# EAGLE design Grove - Mini I2C Motor Driver v1.0 (EAGLE 7.1.0)

## Sheet 1 of 2
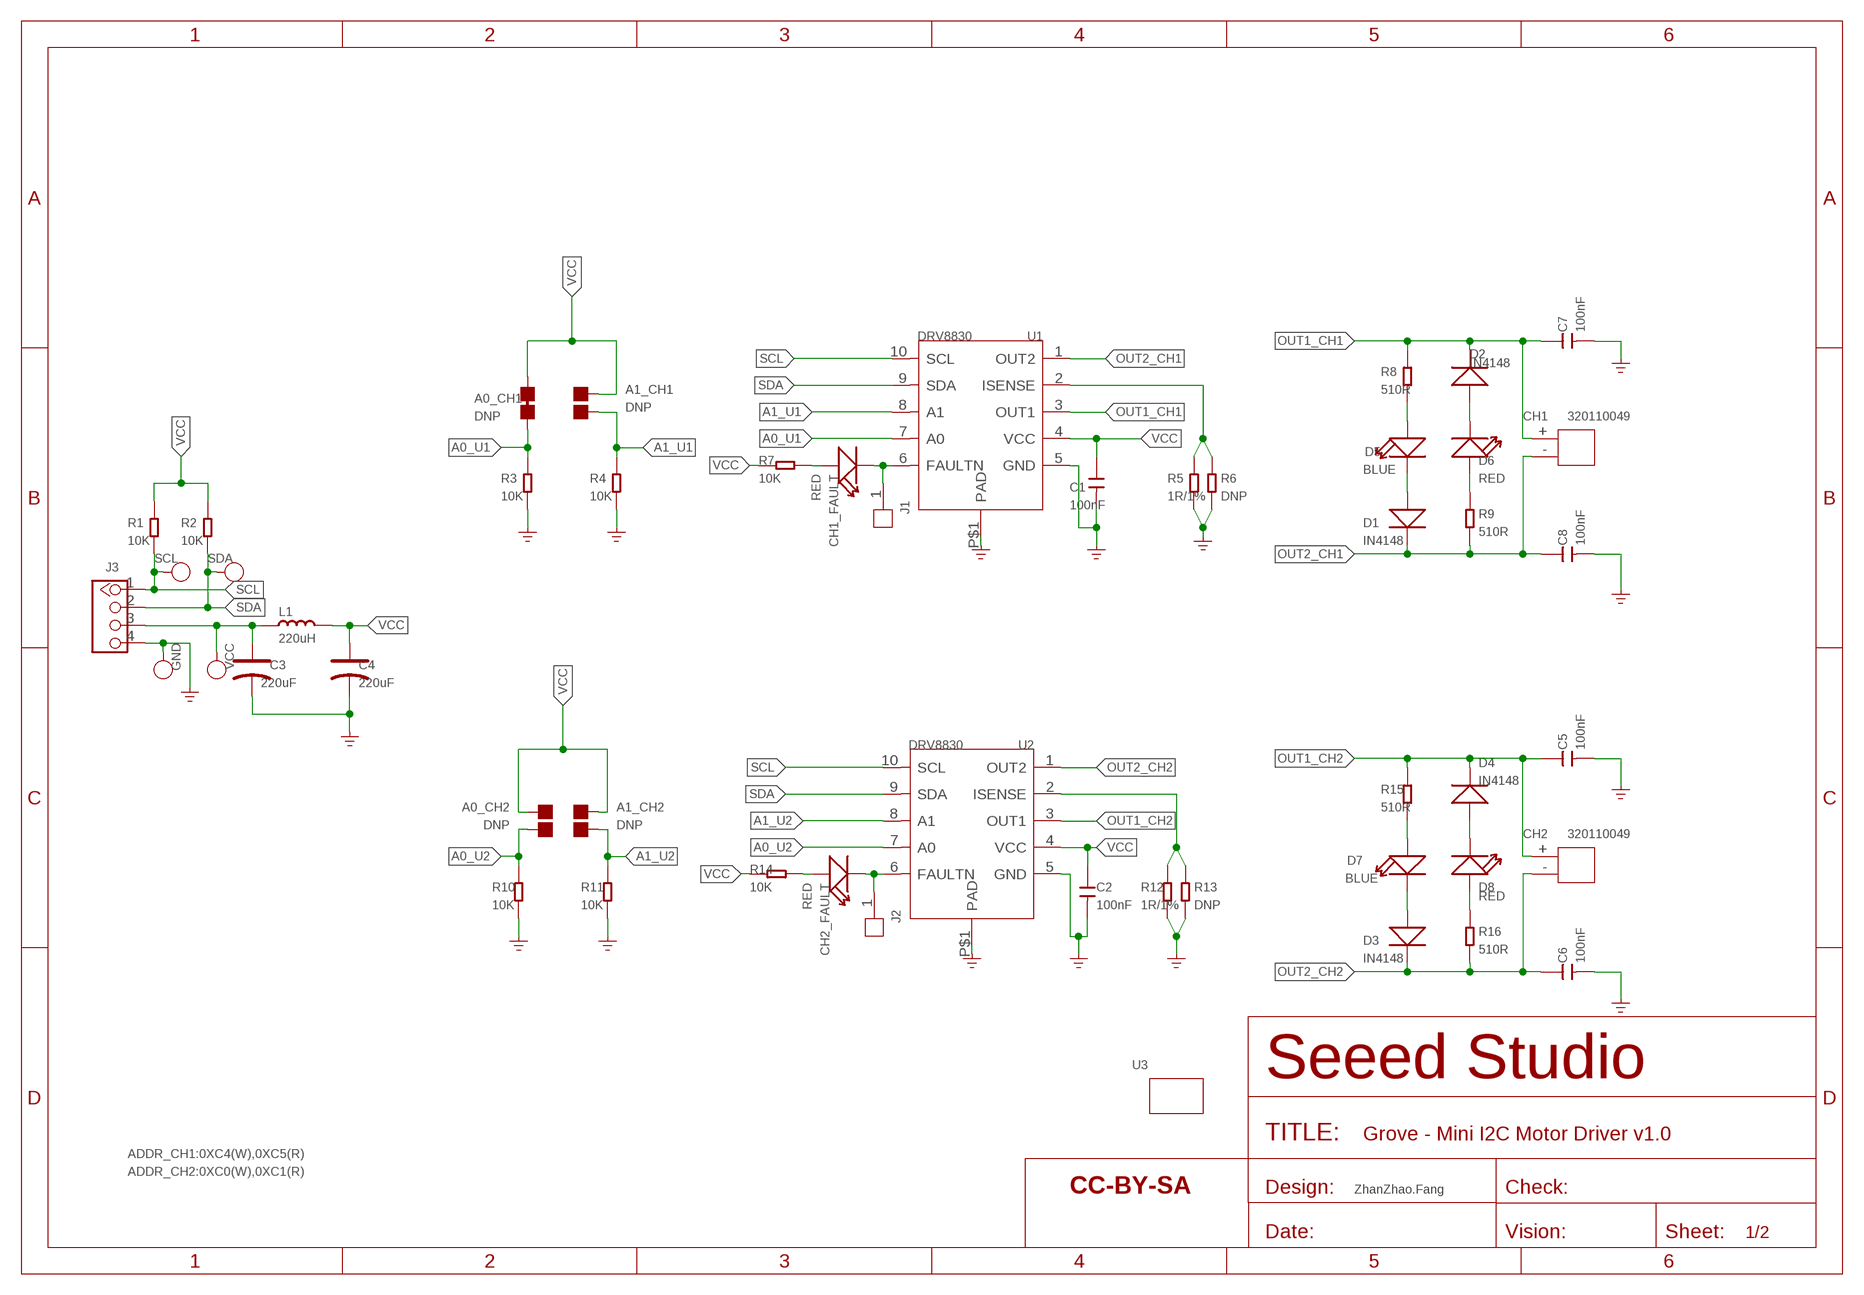
[diagram p0: schematic, sheet 1]

### Parts
A0_CH1  DNP  JUMPER-2P-SHORT  [2P-SMD-SHORT]
A0_CH2  DNP  JUMPER-2P  [JUMPER-2P]
A1_CH1  DNP  JUMPER-2P  [JUMPER-2P]
A1_CH2  DNP  JUMPER-2P  [JUMPER-2P]
C1  100nF  CAP-0603  [C0603]
C2  100nF  CAP-0603  [C0603]
C3  220uF  CAP-POLAR-AVX-B  [AVX-B]
C4  220uF  CAP-POLAR-AVX-B  [AVX-B]
C5  100nF  CAP-0603  [C0603]
C6  100nF  CAP-0603  [C0603]
C7  100nF  CAP-0603  [C0603]
C8  100nF  CAP-0603  [C0603]
CH1  320110049  JST-2P-DIP'2.0'  [H2-2.0-6X4.5MM]
CH1_FAULT  RED  LED'0603'  [LED-0603]
CH2  320110049  JST-2P-DIP'2.0'  [H2-2.0-6X4.5MM]
CH2_FAULT  RED  LED'0603'  [LED-0603]
D1  IN4148  DIODE'0805'  [SOD-323]
D2  IN4148  DIODE'0805'  [SOD-323]
D3  IN4148  DIODE'0805'  [SOD-323]
D4  IN4148  DIODE'0805'  [SOD-323]
D5  BLUE  LED'0603'  [LED-0603]
D6  RED  LED'0603'  [LED-0603]
D7  BLUE  LED'0603'  [LED-0603]
D8  RED  LED'0603'  [LED-0603]
GND  DNP  TEST-POINT'4545'  [TP-D45MIL]
J1  HEADER-1P-40  [1P-80/40MIL]
J2  HEADER-1P-40  [1P-80/40MIL]
J3  GROVE-CONNECTOR-DIP-2.0  [HW4-2.0]
L1  220uH  INDUCTOR/FERRITE-BEAD  [INT2-SMD-4.8X4.8X3MM]
R1  10K  RES-0603  [R0603]
R2  10K  RES-0603  [R0603]
R3  10K  RES-0603  [R0603]
R4  10K  RES-0603  [R0603]
R5  1R/1%  RES-0603  [R0603]
R6  DNP  RES-0603  [R0603]
R7  10K  RES-0603  [R0603]
R8  510R  RES-0603  [R0603]
R9  510R  RES-0603  [R0603]
R10  10K  RES-0603  [R0603]
R11  10K  RES-0603  [R0603]
R12  1R/1%  RES-0603  [R0603]
R13  DNP  RES-0603  [R0603]
R14  10K  RES-0603  [R0603]
R15  510R  RES-0603  [R0603]
R16  510R  RES-0603  [R0603]
SCL  DNP  TEST-POINT'4545'  [TP-D45MIL]
SDA  DNP  TEST-POINT'4545'  [TP-D45MIL]
U1  DRV8830  DRIVER-DRV8830  [MSOP10-0.5-3X3MM]
U2  DRV8830  DRIVER-DRV8830  [MSOP10-0.5-3X3MM]
U3  GROVE'2U'  [GROVE-1*2-TEST-PLATFORM]
U$1  SEEEDSTUDIO-OPEN-SCH-FRAME  [SEEEDSTUDIO-PCB-FRAME]
VCC  DNP  TEST-POINT'4545'  [TP-D45MIL]

### Nets
A0_U1: A0_CH1.1 R3.2 U1.7(A0)
A0_U2: A0_CH2.1 R10.2 U2.7(A0)
A1_U1: A1_CH1.1 R4.2 U1.8(A1)
A1_U2: A1_CH2.1 R11.2 U2.8(A1)
GND: C1.2 C2.2 C3.- C4.- C5.2 C6.2 C7.2 C8.2 GND.T J3.4 R3.1 R4.1 R5.1 R6.1 R10.1 R11.1 R12.1 R13.1 U1.5(GND) U1.P$1(PAD) U2.5(GND) U2.P$1(PAD) ; supply symbol labelled GND_POWER
N$1: R5.2 R6.2 U1.2(ISENSE)
N$2: R12.2 R13.2 U2.2(ISENSE)
N$3: CH1_FAULT.- J1.1 U1.6(FAULTN)
N$4: CH1_FAULT.+ R7.1
N$5: CH2_FAULT.- J2.1 U2.6(FAULTN)
N$6: CH2_FAULT.+ R14.1
N$7: D1.+ D5.-
N$8: D6.+ R9.2
N$9: D2.+ D6.-
N$10: D5.+ R8.1
N$11: D3.+ D7.-
N$12: D7.+ R15.1
N$13: D4.+ D8.-
N$14: D8.+ R16.2
N$15: C3.+ J3.3 L1.1 VCC.T
OUT1_CH1: C7.1 CH1.+ D2.- R8.2 U1.3(OUT1)
OUT1_CH2: C5.1 CH2.+ D4.- R15.2 U2.3(OUT1)
OUT2_CH1: C8.1 CH1.- D1.- R9.1 U1.1(OUT2)
OUT2_CH2: C6.1 CH2.- D3.- R16.1 U2.1(OUT2)
SCL: J3.1 R1.1 SCL.T U1.10(SCL) U2.10(SCL)
SDA: J3.2 R2.1 SDA.T U1.9(SDA) U2.9(SDA)
VCC: A0_CH1.2 A0_CH2.2 A1_CH1.2 A1_CH2.2 C1.1 C2.1 C4.+ L1.2 R1.2 R2.2 R7.2 R14.2 U1.4(VCC) U2.4(VCC)

### Notes on the sheet
- ADDR_CH1:0XC4(W),0XC5(R)
- ADDR_CH2:0XC0(W),0XC1(R)
- ZhanZhao.Fang

## Sheet 2 of 2

## Library data of the parts
A0_CH1 = Discrete-new:JUMPER-2P-SHORT
A0_CH2 A1_CH1 A1_CH2 = Discrete-new:JUMPER-2P; PARTNO: DNP
C1 C2 C5-C8 = Discrete-new:CAP: Ceramic Capacitors
C3 C4 = Discrete-new:CAP-POLAR: Electrolytic Capacitors,Tantalum Capacitors and Super Capacitors
CH1 CH2 = Connector-new:JST-2P-DIP: 2P-2.0:320110049;2P-2.0-90D:320110027;2P-2.54:320110053;2P-2.54-90D:320110000
CH1_FAULT CH2_FAULT D5-D8 = Discrete-new:LED
D1-D4 = Discrete-new:DIODE*
GND SCL SDA VCC = Discrete-new:TEST-POINT; PARTNO: DNP
J1 J2 = Connector-new:HEADER-1P
J3 = Connector-new:GROVE-CONNECTOR-DIP: 4P-2.0:320110033;4P-2.0-90D:320110034
L1 = Discrete-new:INDUCTOR/FERRITE-BEAD
R1-R16 = Discrete-new:RES
U1 U2 = template:DRIVER-DRV8830
U3 = moudle-new:GROVE
U$1 = moudle-new:SEEEDSTUDIO-OPEN-SCH-FRAME

## Board
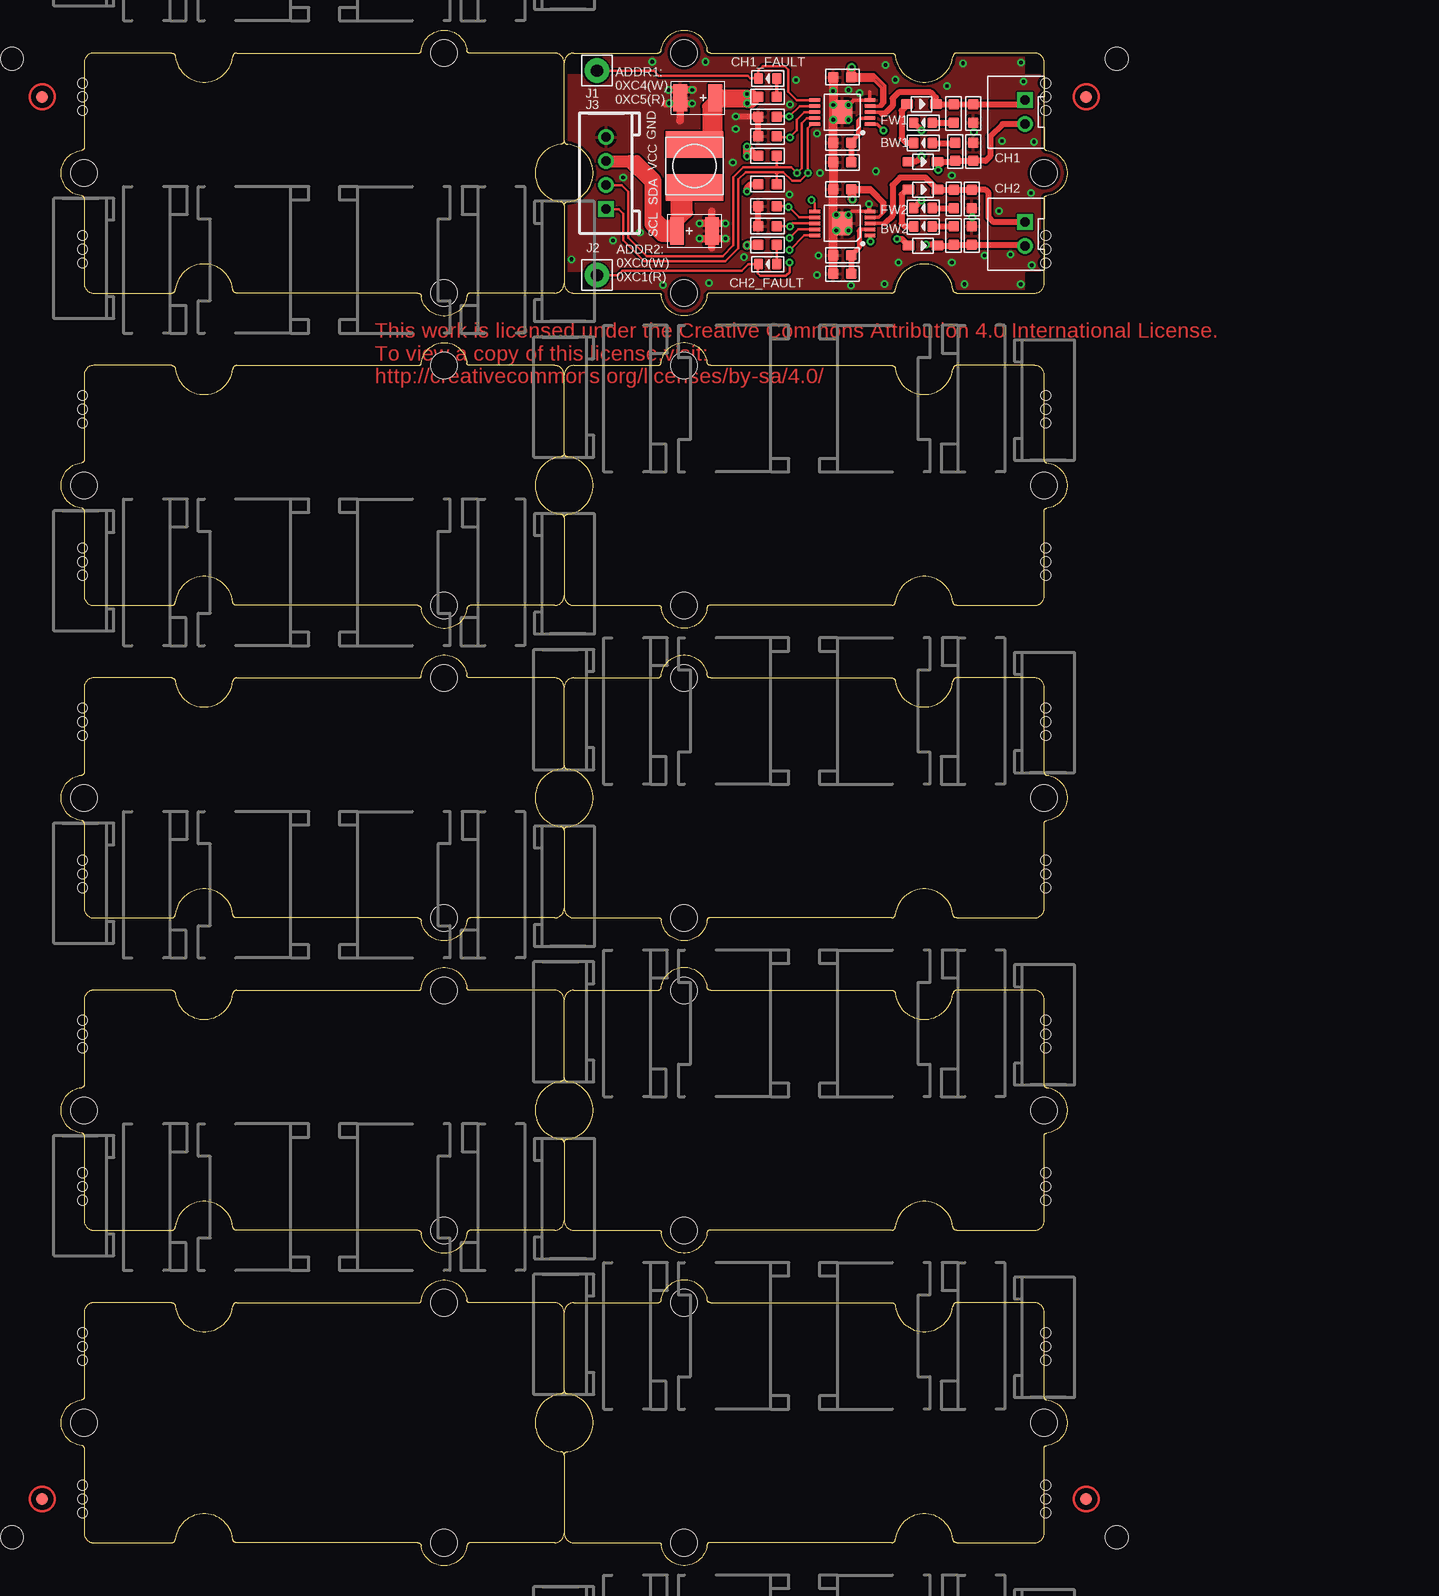
[diagram p1: board, top side]
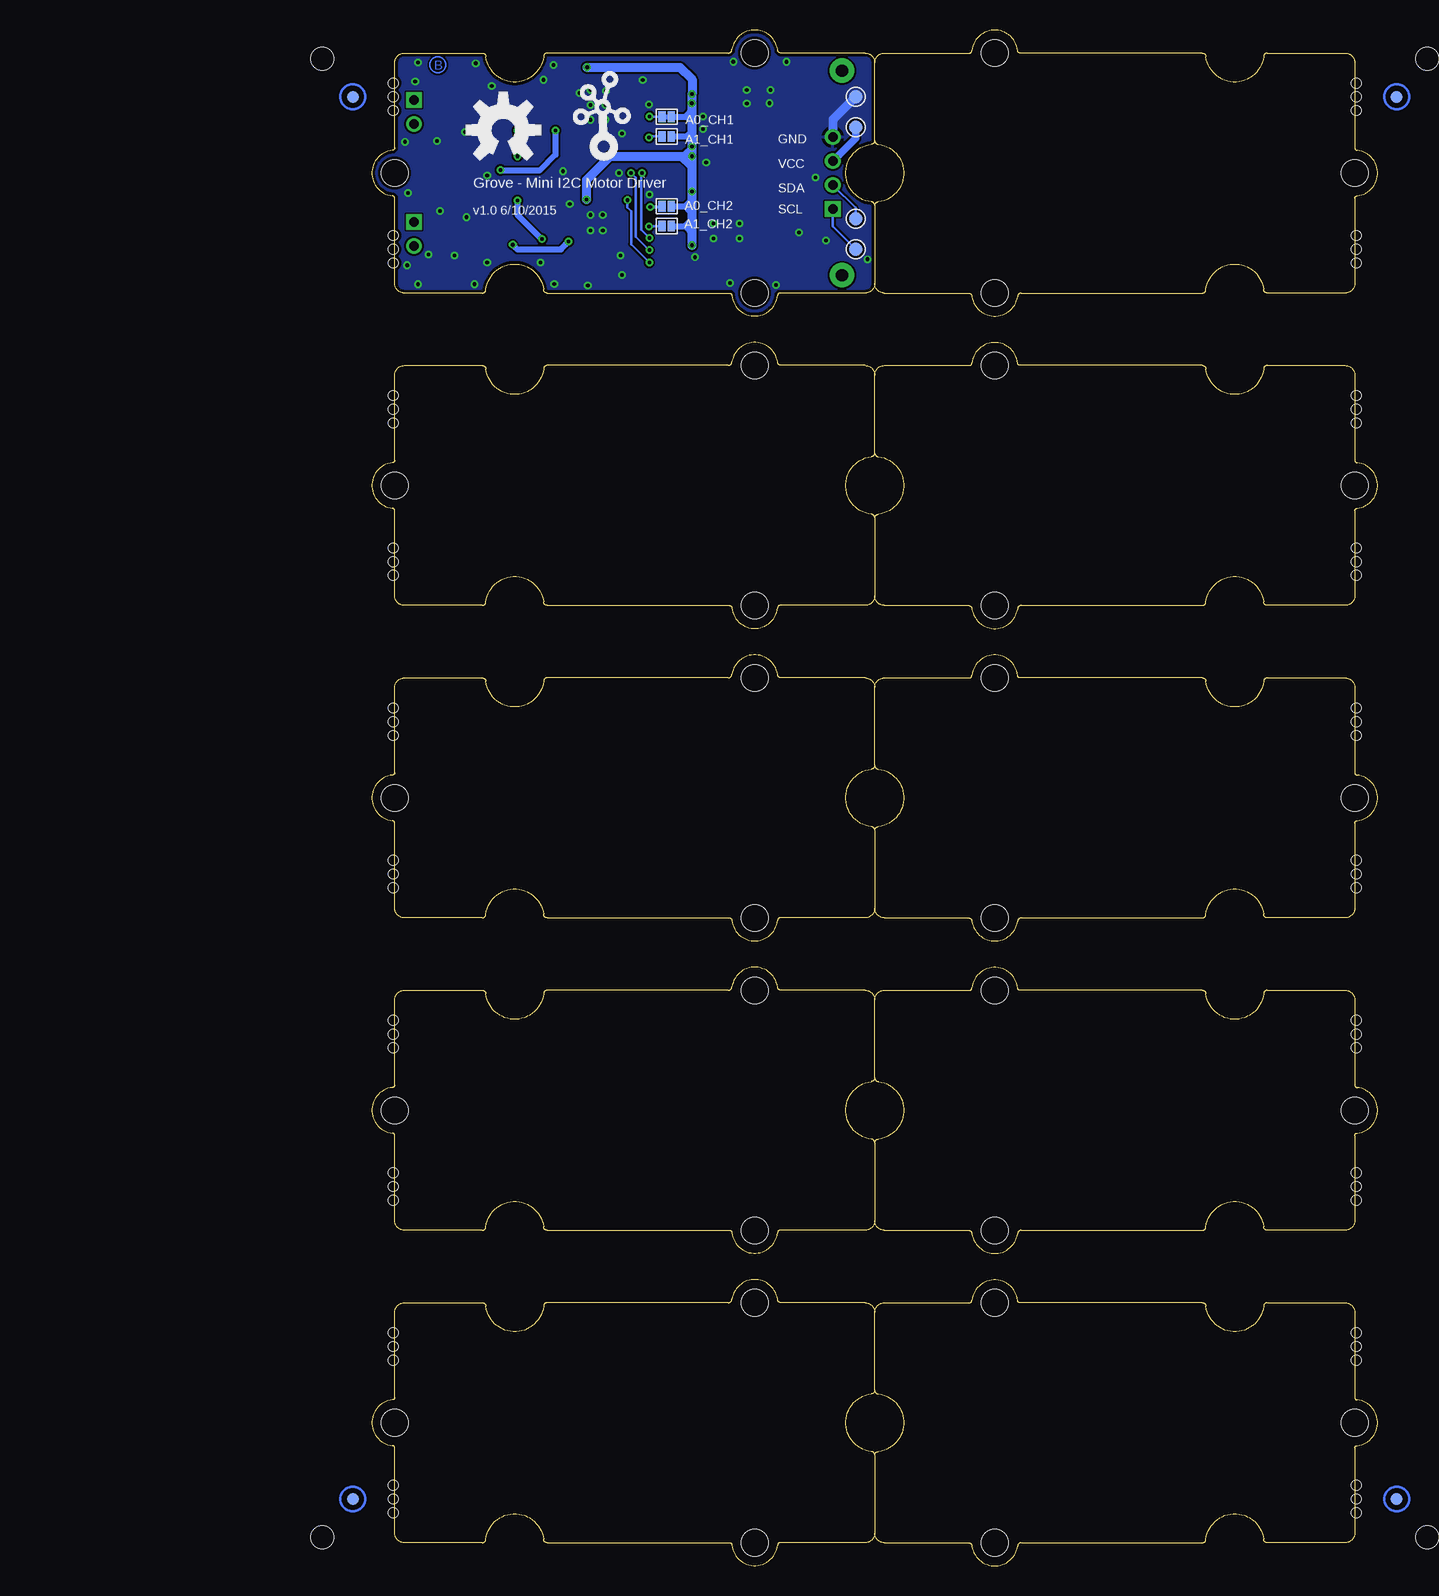
[diagram p2: board, bottom side, seen from below]

Size 83.82 x 127.98 mm. Coordinates in mm from the lower left corner, seen from the top.
Copper layers (1*16): Top 0.035mm / dielectric 1.5mm / Bottom 0.035mm
Design rules "SeeedStudio_2layer_DRU_no_angle_20140221 *": minimum track width 6mil, minimum drill 10mil, track to track 6mil, track to pad 10mil, pad to pad 10mil, via to via 6mil, smd to smd 0mil, copper to edge 10mil, drill to drill 10mil, minimum pad ring 10mil, minimum via ring 6mil, stop-mask expansion 2mil, vias tented up to drill 25mil, thermal gap 10mil
Holes 0.8 mm at 1.78,123.55 1.78,121.27 1.78,122.41 1.78,110.85 1.78,108.57 1.78,109.71 1.78,97.52 1.78,95.23 1.78,96.38 1.78,84.82 1.78,82.53 1.78,83.68 1.78,71.48 1.78,69.2 1.78,70.34 1.78,58.78 1.78,56.5 1.78,57.64 1.78,45.45 1.78,43.16 1.78,44.31 1.78,32.75 1.78,30.46 1.78,31.61 1.78,19.41 1.78,17.13 1.78,18.27 1.78,6.71 1.78,4.43 1.78,5.57 82.04,121.27 82.04,123.55 82.04,122.41 82.04,108.57 82.04,110.85 82.04,109.71 82.04,95.23 82.04,97.52 82.04,96.38 82.04,82.53 82.04,84.82 82.04,83.68 82.04,69.2 82.04,71.48 82.04,70.34 82.04,56.5 82.04,58.78 82.04,57.64 82.04,43.16 82.04,45.45 82.04,44.31 82.04,30.46 82.04,32.75 82.04,31.61 82.04,17.13 82.04,19.41 82.04,18.27 82.04,4.43 82.04,6.71 82.04,5.57
Holes 1.91 mm at -4.13,2.4 87.95,2.4 87.95,125.59 -4.13,125.59

### Footprints (pad centres in the part's own frame; a part is rotated, then mirrored left to right if it is on the bottom)
2P-SMD-SHORT = smd 0.889 x 0.61: 1 0,0.381; 2 0,-0.381
JUMPER-2P = smd 0.889 x 0.61: 1 0,0.381; 2 0,-0.381
C0603 = smd 0.889 x 0.889: 1 0,0.762; 2 0,-0.762
AVX-B = smd 1.143 x 2.286: + -1.46,0; - 1.46,0
H2-2.0-6X4.5MM = drill 0.8 pad 1.3 square: + -1,0.75 | drill 0.8 pad 1.3: - 1,0.75
LED-0603 = smd 0.762 x 0.889: + -0.762,0; - 0.762,0
SOD-323 = smd 1 x 0.8: + -1.2,0; - 1.2,0
TP-D45MIL = smd 1.143 x 1.143: T 0,0
1P-80/40MIL = drill 1.016 pad 2.032: 1 0,0
HW4-2.0 = drill 0.8 pad 1.27 square: 1 -3,0 | drill 0.8 pad 1.27: 2 -1,0; 3 1,0; 4 3,0
INT2-SMD-4.8X4.8X3MM = smd 2.2 x 4.8: 1 -1.8,0; 2 1.8,0
ROUND-MARK-1.0 = smd 1.016 x 1.016: P$1 0,0
R0603 = smd 0.889 x 0.889: 1 0,0.762; 2 0,-0.762
MSOP10-0.5-3X3MM = smd 0.305 x 0.889: 1 -1,-2.3; 2 -0.5,-2.3; 3 0,-2.3; 4 0.5,-2.3; 5 1,-2.3; 6 1,2.3; 7 0.5,2.3; 8 0,2.3; 9 -0.5,2.3; 10 -1,2.3 | smd 2 x 1.73: P$1 0,0
GROVE-1*2-TEST-PLATFORM = hole 2.2: -10,-10; -10,10; 20,0
GROVE-TEST-PLATFORM = hole 2.2: -10,-10; -10,10; 20,0

### Placement (x,y rotation side)
A0_CH1  59.25,120.76 90 bottom
A0_CH2  59.25,113.29 90 bottom
A1_CH1  59.25,119.11 90 bottom
A1_CH2  59.25,111.64 90 bottom
C1  65.09,124.06 270 top
C2  65.09,114.72 270 top
C3  52.77,111.24 0 top
C4  53.05,122.34 180 top
C5  75.88,113.9 0 top
C6  75.88,110.85 180 top
C7  76.01,121.01 0 top
C8  76.01,117.84 180 top
CH1  79.57,121.14 270 top
CH1_FAULT  58.87,123.94 180 top
CH2  79.57,110.98 270 top
CH2_FAULT  58.87,108.47 180 top
D1  71.82,117 0 top
D2  71.69,121.81 0 top
D3  71.82,110.02 0 top
D4  71.82,114.69 0 top
D5  71.82,120.25 180 top
D6  71.82,118.56 180 top
D7  71.82,113.14 180 top
D8  71.82,111.62 180 top
GND  43.5,122.41 0 bottom
J1  44.64,124.6 0 top
J2  44.64,107.55 0 top
J3  45.4,116.06 90 top
L1  52.77,116.65 90 top
P1  [ROUND-MARK-1.0]  -1.59,5.57 0 top
P2  [ROUND-MARK-1.0]  85.41,5.57 0 top
P3  [ROUND-MARK-1.0]  -1.59,122.41 0 top
P4  [ROUND-MARK-1.0]  85.41,122.41 0 top
P5  [ROUND-MARK-1.0]  -1.59,5.57 0 bottom
P6  [ROUND-MARK-1.0]  85.41,5.57 0 bottom
P7  [ROUND-MARK-1.0]  85.41,122.41 0 bottom
P8  [ROUND-MARK-1.0]  -1.59,122.41 0 bottom
R1  58.87,115.15 270 top
R2  58.87,117.51 270 top
R3  58.87,120.76 90 top
R4  58.87,119.11 90 top
R5  65.09,118.6 90 top
R6  65.09,116.95 90 top
R7  58.87,122.41 270 top
R8  74.36,121.01 180 top
R9  74.5,117.84 180 top
R10  58.87,113.29 90 top
R11  58.87,111.64 90 top
R12  65.09,109.2 90 top
R13  65.09,107.68 90 top
R14  58.87,110.07 270 top
R15  74.37,113.9 180 top
R16  74.36,110.85 180 top
SCL  43.5,109.71 0 bottom
SDA  43.5,112.25 0 bottom
U1  65.09,121.14 90 top
U2  65.09,111.87 90 top
U3  61.91,116.06 0 top
U4  [GROVE-TEST-PLATFORM]  61.91,37.96 0 top
U5  [GROVE-TEST-PLATFORM]  21.91,37.96 180 top
U6  [GROVE-TEST-PLATFORM]  61.91,63.99 0 top
U7  [GROVE-TEST-PLATFORM]  21.91,63.99 180 top
U8  [GROVE-TEST-PLATFORM]  61.91,90.03 0 top
U9  [GROVE-TEST-PLATFORM]  21.91,90.03 180 top
U10  [GROVE-TEST-PLATFORM]  21.91,116.06 180 top
U11  [GROVE-TEST-PLATFORM]  61.91,116.06 0 top
U12  [GROVE-TEST-PLATFORM]  61.91,11.92 0 top
U13  [GROVE-TEST-PLATFORM]  21.91,11.92 180 top
U$1  26.12,98.51 0 top
U$8  [OSHW_FILLX250_NOTEXT]  72.86,119.64 0 bottom
U$14  [GROVE-SILK-BIG]  64.55,118.07 0 bottom
VCC  43.5,119.87 0 bottom

### Tracks (layer width: path | path; a pad name or v marks a point on that pad's centre or on a via)
A0_U1  (via drill 0.3 pad 0.64)
  Top 0.203: A0_CH1.1 59.65,120.79 v60.67,120.79 61.52,121.64 U1.7
  Bottom 0.203: A0_CH1.1 60.64,120.76 v60.67,120.79
A0_U2  (via drill 0.3 pad 0.64)
  Top 0.203: A0_CH2.1 60.57,113.29 v60.62,113.24 61.49,112.37 U2.7
  Bottom 0.254: v60.62,113.24 59.68,113.24 A0_CH2.1
A1_U1  (via drill 0.3 pad 0.64)
  Top 0.203: R4.2 59.68,119.06 60.69,119.06 v60.72,119.03 61.3,119.62 61.3,120.51 61.94,121.14 U1.8
  Bottom 0.203: R4.2 60.64,119.11 v60.72,119.03
A1_U2  (via drill 0.3 pad 0.64)
  Top 0.203: A1_CH2.1 60.69,111.64 v60.72,111.62 60.97,111.87 U2.8
  Bottom 0.203: A1_CH2.1 60.69,111.64 v60.72,111.62
GND  (via drill 0.3 pad 0.64)
  Top 0.305: 66.09,122.14 U1.5 67.37,122.16 67.37,122.84 | 66.09,122.14 U1.P$1 | 67.2,112.87 U2.5 67.39,113.43 v67.32,113.5 | 67.2,112.87 65.89,112.87 v65.6,112.58 | 66.09,122.14 66.01,122.14 v65.6,121.73 | 67.2,112.87 67.27,112.95 67.27,113.39
  Top 0.508: R11.1 R10.1 | R4.1 R3.1 v56.21,120.76
  Top 0.635: v53.19,111.87 54.22,111.87 | 54.22,111.87 55.31,111.87 | v53.19,110.6 55.44,110.6 | v50.6,123 52.67,123 | v52.58,121.85 50.38,121.85 | 54.22,111.87 54.22,112.89 | C3.- 54.23,109.85 54.22,109.84 | C4.- 51.59,120.47 51.55,120.43
  Top 0.762: 64.33,120.38 R5.1 R6.1 C2.2 R12.1 R13.1 | 64.33,120.38 U1.P$1 | C1.2 64.33,120.38
  Bottom 0.762: GND.T 45.4,120.51 J3.4
  other vias: 66.51,122.74 64.34,121.73 64.34,120.51 65.6,120.51 64.58,112.58 64.58,111.26 65.6,111.26 80.2,123.68 65.82,106.69 79.97,125.28 42.52,108.87 50.14,106.74 53.98,106.89 53.7,125.33 64.31,122.89 65.61,123 61.24,123.81 60.73,121.78 56.21,119.74 56.9,109.05 45.97,110.45 75.26,106.79 79.96,106.79 49.25,125.33 48.21,111.11 52.58,123 50.67,121.88 68.68,125.08 75.16,125.21 76.05,119.49 75.92,112.38 46.84,115.68 55.35,111.87 55.35,110.6 60.68,114.28 63.09,109.2 62.97,107.55 63.22,116.06 62.97,119.36 67.88,116.21 74.21,115.87 78.4,118.73 81.06,118.66 80.81,114.41 78.14,112.89 80.87,108.38 79.1,109.27 76.94,109.2 55.96,116.95 68.62,106.82 69.76,108.59 74.21,108.59 69.51,123.83 73.83,123.33
  pour Bottom: 41.21,129.14 83.63,129.14 83.63,105.77 83.63,104.38 39.82,104.38 39.82,129.14
  pour Top: 39.82,129.4 83.63,129.4 83.63,104.25 39.82,104.25
N$1
  Top 0.305: U1.2 66.62,120.64 | 66.62,120.64 66.49,120.51 66.49,119.24 R5.2 | 66.62,120.64 66.6,120.64 66.36,120.4 66.36,119.29 65.95,118.88
  Top 0.508: R5.2 R6.2
N$2
  Top 0.305: 66.46,109.81 R12.2 | U2.2 66.62,111.37 66.61,111.36
  Top 0.406: 66.61,111.36 66.49,111.24 66.49,109.84 R12.2
  Top 0.508: R12.2 R13.2
N$3
  Top 0.203: U1.6 61.29,122.14 60.59,122.84 60.59,124.67 60.29,124.98 58.46,124.98 58.1,124.62 CH1_FAULT.- 58.08,123.96 57.42,123.96 57.21,124.16 49.8,124.16 49.37,124.6 J1.1
N$4
  Top 0.305: R7.1 CH1_FAULT.+
N$5  (via drill 0.3 pad 0.64)
  Top 0.203: U2.6 62.79,113.54 v62.52,113.8 | v60.69,108.62 60.69,107.81 60.39,107.5 58.26,107.5 58.05,107.7 58.05,108.42 CH2_FAULT.- 57.27,108.47 56.71,107.91 46.75,107.91 46.39,107.55 J2.1
  Bottom 0.203: v62.52,113.8 62.52,113.19 62.22,112.89 62.22,110.14 v60.69,108.62
N$6
  Top 0.203: CH2_FAULT.+ R14.1
N$7  (via drill 0.3 pad 0.64)
  Top 0.508: D1.+ 70.68,117.06 71.29,117.06 v71.69,117.46 | D5.- v71.69,119.62
  Bottom 0.508: v71.69,119.62 v71.69,117.46
N$8
  Top 0.508: D6.+ 74.46,118.56 R9.2
N$9
  Top 0.508: 70.46,121.81 70.33,121.81 | D2.+ 70.46,121.81 | 70.46,121.81 70.46,121.69 70.04,121.27 70.04,118.98 70.46,118.56 D6.-
N$10
  Top 0.508: D5.+ R8.1
N$11  (via drill 0.3 pad 0.64)
  Top 0.508: D7.- v71.69,113.78 | D3.+ 70.07,110.56 v69.65,110.56
  Bottom 0.508: v71.69,113.78 71.69,112.61 v69.65,110.56
N$12
  Top 0.508: D7.+ R15.1
N$13
  Top 0.508: D4.+ 70.45,114.69 70.04,114.28 70.04,111.87 70.3,111.62 D8.-
N$14
  Top 0.508: D8.+ R16.2
N$15
  Top 1.016: 47.35,117.06 47.96,117.06 49.49,115.53 49.49,112.38 | 49.49,112.38 49.49,111.87 50.2,111.16 51.23,111.16 C3.+ 51.31,111.96 | 51.31,111.96 51.31,115.03 | 51.31,115.03 51.22,115.12 | 51.31,115.03 52.58,115.03 L1.1 | 51.31,111.96 52.13,112.78 52.13,114.51 52.24,114.61 | J3.3 47.35,117.06 | 47.35,117.06 49.09,115.32 49.09,111.77 50,110.85 51.12,110.85 51.22,110.75 | 51.31,111.96 51.02,111.67 50.2,111.67 49.49,112.38
  Bottom 0.635: VCC.T 43.5,118.97 J3.3
N$16
  cutout Top: 50.36,119.36 50.36,114.41 55.18,114.41 55.18,119.36
OUT1_CH1
  Top 0.305: 68.14,121.14 68.77,121.14 | U1.3 68.14,121.14 | 68.14,121.14 68.39,120.89 68.64,120.89 68.77,121.01
  Top 0.508: 80.21,122.03 CH1.+ 79.95,121.78 C7.1 R8.2 74.32,121.81 D2.- 72.89,122.35 72.45,122.79 69.79,122.79 69.28,122.28 69.28,121.65 68.77,121.14
OUT1_CH2
  Top 0.305: U2.3 68.64,111.87
  Top 0.508: CH2.+ 77.68,111.98 77.28,112.38 77.28,114.41 77.03,114.66 C5.1 R15.2 74.35,114.69 D4.- 72.89,114.82 72.03,115.68 69.91,115.68 69.28,115.05 69.28,112.51 68.64,111.87
OUT2_CH1  (via drill 0.3 pad 0.64)
  Top 0.305: U1.1 67.99,120.14 v68.52,119.62
  Top 0.508: v73.09,116.32 73.09,116.82 72.96,116.94 D1.- 74.42,117 R9.1 C8.1 77.03,117.08 77.41,117.46 77.41,119.11 78.44,120.14 CH1.-
  Bottom 0.508: v73.09,116.32 69.79,116.32 68.52,117.59 v68.52,119.62
OUT2_CH2  (via drill 0.3 pad 0.64)
  Top 0.305: 67.36,110.87 U2.1 67.4,110.85 67.4,110.38 v67.44,110.35
  Top 0.508: CH2.- 80.21,110.09 C6.1 R16.1 74.28,110.02 D3.- 72.77,110.02 72.69,110.09 v72.07,110.09
  Bottom 0.508: v67.44,110.35 68.07,109.71 71.69,109.71 v72.07,110.09
SCL  (via drill 0.3 pad 0.64)
  Top 0.203: 59.78,116.14 60.19,116.14 60.9,115.43 61.58,115.43 v62.22,116.06 62.22,119.8 62.56,120.14 U1.10 | 59.78,116.14 59.48,116.14 | U2.10 61.93,110.87 v60.69,109.64 | 59.63,115.99 59.48,116.14 | 59.63,115.99 59.78,116.14 | 59.63,115.99 R1.1 | J3.1 46.47,113.06 46.85,112.68 46.85,110.45 48.58,108.72 55.33,108.72 56.43,109.81 56.43,115.53 57.04,116.14 59.48,116.14
  Bottom 0.203: J3.1 45.4,111.62 SCL.T | v60.69,109.64 61.81,110.75 61.81,115.66 v62.22,116.06
SDA  (via drill 0.3 pad 0.64)
  Top 0.203: 59.78,116.54 59.68,116.54 | 59.68,116.54 59.48,116.54 | U2.9 61.41,111.37 v60.69,110.65 | R2.1 59.63,116.7 | 59.63,116.7 59.63,116.59 59.68,116.54 | 59.63,116.7 59.48,116.54 | 59.63,116.7 59.78,116.54 | 59.78,116.54 60.83,116.54 v61.32,116.06 61.71,116.46 61.71,120.22 62.13,120.64 U1.9 | J3.2 46.71,115.06 47.26,114.51 47.26,110.65 48.78,109.13 55.11,109.13 56.02,110.04 56.02,115.73 56.83,116.54 59.48,116.54
  Bottom 0.203: J3.2 43.5,113.16 SDA.T | v60.69,110.65 61.38,111.34 61.38,116 v61.32,116.06
VCC  (via drill 0.3 pad 0.64)
  Top 0.305: U2.4 68.13,112.37 68.39,112.63 | C2.1 66,114.72 66.21,114.51 67.43,114.51 68.39,113.55 68.39,112.63 | 65.77,123.81 67.76,123.81 68.39,123.17 68.39,121.9 68.13,121.64 U1.4 68.38,121.64 68.64,121.9 68.64,123.33 67.91,124.06 | 67.91,124.06 C1.1 | 67.91,124.06 67.7,124.27 66.08,124.27 65.98,124.16 | 68.39,112.63 68.64,112.89 68.64,113.65 67.63,114.66 | 67.63,114.66 65.85,114.66 | 67.63,114.66 67.48,114.82 65.75,114.82
  Top 0.508: R2.2 58.1,117.46 v57.14,117.46 | 58.1,115.12 R1.2 58.08,115.12 57.42,115.12 57.14,114.84 v57.14,114.51
  Top 0.635: v57.14,117.46 57.14,118.17 | 57.14,118.17 v57.14,118.27 | 57.14,118.17 57.24,118.17 | 57.24,118.17 57.85,117.56 | 57.24,118.17 57.24,117.97 | R2.2 57.27,117.51
  Top 0.762: R14.2 58.1,110.04 v57.14,110.04 | C1.1 65.85,124.85 v65.88,124.88 | v65.93,113.85 65.93,114.64 C2.1 | v57.14,122.64 55,122.64 54.7,122.34 C4.+ | 54.83,121.98 54.93,121.88 v57.16,121.88 57.57,121.88 R7.2 58.08,122.44 57.34,122.44 v57.14,122.64 | C4.+ 54.42,122.34 | 53.66,118.6 53.79,118.73 53.79,121.61 C4.+ | v57.14,122.64 57.62,122.64 57.93,122.34
  Top 1.016: C4.+ 54.57,122.27 54.57,118.58 | L1.2 53.5,118.45 53.66,118.6
  Bottom 0.508: A0_CH2.2 57.72,113.29 | 57.7,113.29 57.44,113.29 57.14,113.6 | A1_CH2.2 57.74,111.64 | 57.74,111.64 57.16,111.64 | A1_CH1.2 57.6,119.11 | 57.6,119.11 57.27,119.11 57.14,118.98 | A0_CH1.2 57.72,120.76 | 57.6,120.76 57.19,120.76 57.14,120.71 | v57.14,118.27 57.9,117.51 R2.2 | 57.72,113.29 57.7,113.29 | 57.7,113.29 57.21,113.78 | 57.72,113.29 57.32,112.89 57.21,112.89 | 57.74,111.64 57.26,112.12 57.21,112.12 | 57.74,111.64 57.33,111.24 57.21,111.24 | 57.72,120.76 57.34,121.14 57.21,121.14 | 57.72,120.76 57.6,120.76 | 57.6,120.76 57.09,120.25 | 57.6,119.11 57.21,119.49 | 57.6,119.11 57.34,118.86
  Bottom 0.762: v57.14,110.04 57.14,111.67 | 57.14,111.67 57.14,113.6 v57.14,114.51 v57.14,118.27 | v57.14,118.27 v57.14,117.46 57.98,117.46 | v57.14,118.27 57.14,118.98 57.14,120.71 v57.14,122.64 57.14,123.86 58.15,124.88 v65.88,124.88 | 57.16,111.64 57.14,111.67 | 57.98,117.46 63.97,117.46 65.93,115.5 v65.93,113.85 | 57.98,117.46 57.21,116.7
(copper drawn outside any net)
  shapes: Bottom circle x1

### Text on the board
Bottom: B
tPlace: CH1_FAULT | ADDR1: / 0XC4(W) / 0XC5(R) | FW1 | GND | BW1 | CH1 | VCC | CH2 | SDA | FW2 | SCL | BW2 | ADDR2: / 0XC0(W) / 0XC1(R) | CH2_FAULT
bPlace: Grove - Mini I2C Motor Driver | v1.0 6/10/2015